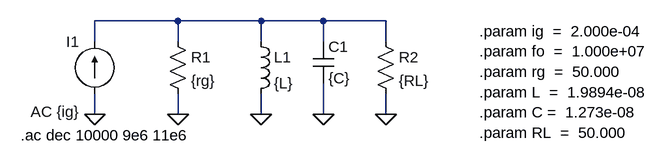
[diagram p0: schematic Draft1.asc]
Draft1.asc, the LTspice schematic file:
Version 4
SHEET 1 880 680
WIRE 64 128 -64 128
WIRE 192 128 64 128
WIRE 288 128 192 128
WIRE 384 128 288 128
WIRE -64 160 -64 128
WIRE 64 160 64 128
WIRE 192 160 192 128
WIRE 288 160 288 128
WIRE 384 160 384 128
WIRE -64 272 -64 240
WIRE 64 272 64 240
WIRE 192 272 192 240
WIRE 288 272 288 224
WIRE 384 272 384 240
FLAG -64 272 0
FLAG 64 272 0
FLAG 192 272 0
FLAG 288 272 0
FLAG 384 272 0
SYMBOL res 48 144 R0
SYMATTR InstName R1
SYMATTR Value {rg}
SYMBOL ind 176 144 R0
SYMATTR InstName L1
SYMATTR Value {L}
SYMBOL cap 272 160 R0
SYMATTR InstName C1
SYMATTR Value {C}
SYMBOL res 368 144 R0
SYMATTR InstName R2
SYMATTR Value {RL}
SYMBOL current -64 240 R180
WINDOW 0 24 80 Left 2
WINDOW 3 24 0 Left 2
WINDOW 123 24 -28 Left 2
WINDOW 39 0 0 Left 0
SYMATTR InstName I1
SYMATTR Value ""
SYMATTR Value2 AC {ig}
TEXT 528 144 Left 2 !.param ig  =  2.000e-04\n.param fo  =  1.000e+07\n.param rg  =  50.000\n.param L  =  1.9894e-08\n.param C =  1.273e-08\n.param RL  =  50.000
TEXT -178 304 Left 2 !.ac dec 10000 9e6 11e6

The netlist it stands for:
* Draft1.asc
R1 N001 0 {rg}
L1 N001 0 {L}
C1 N001 0 {C}
R2 N001 0 {RL}
I1 0 N001 AC {ig}
.param ig  =  2.000e-04
.param fo  =  1.000e+07
.param rg  =  50.000
.param L  =  1.9894e-08
.param C =  1.273e-08
.param RL  =  50.000
.ac dec 10000 9e6 11e6
.backanno
.end